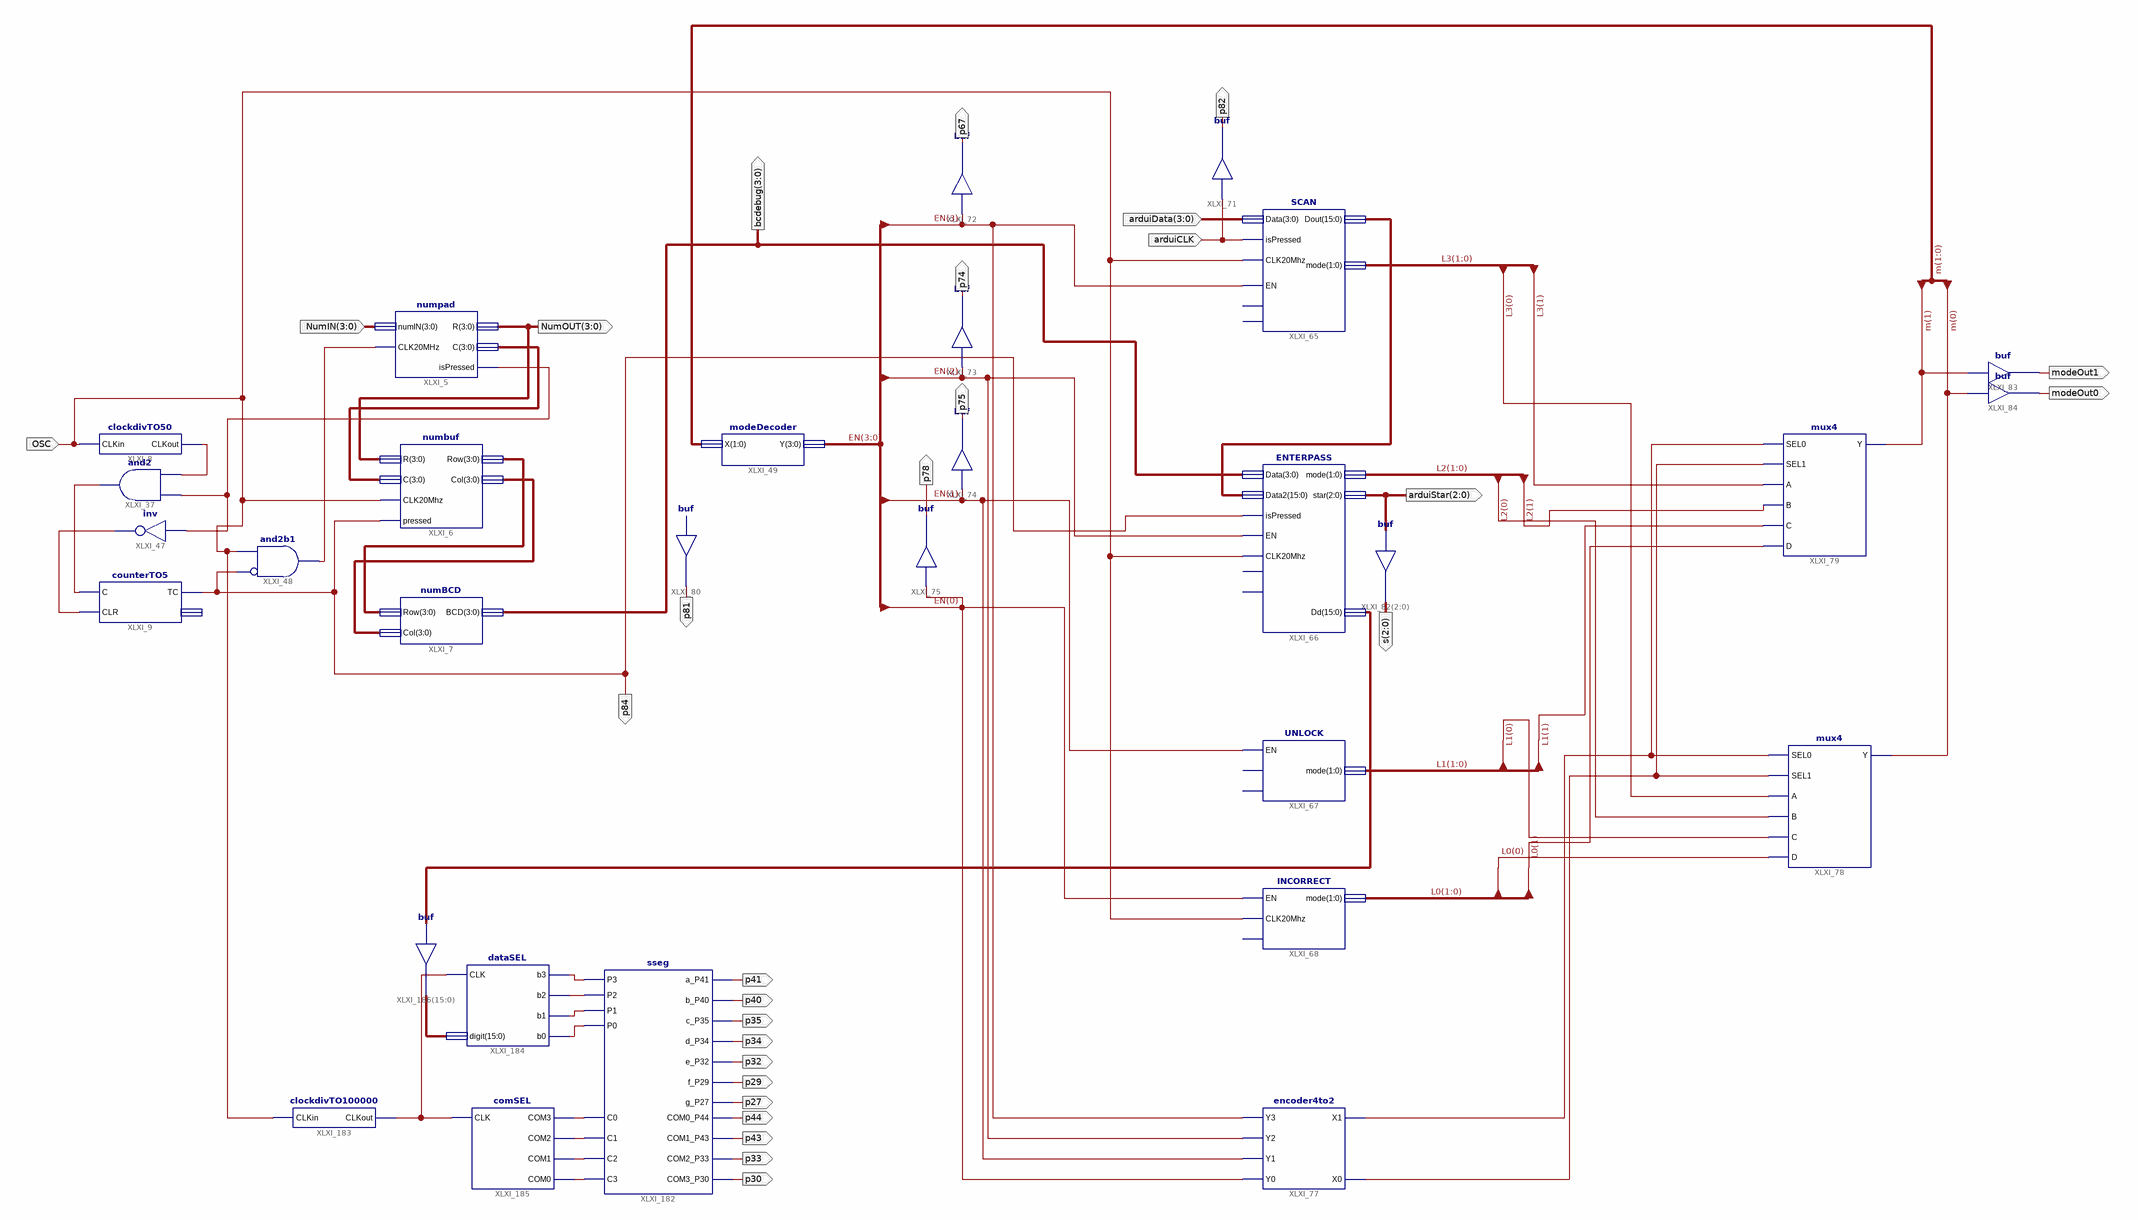
[diagram p0: schematic sheet 1]
// Xilinx ISE schematic main.sch (spartan6) as structural Verilog: 30 symbols, 28 ports
module main (
  input  OSC,
  input  [3:0] arduiData,
  input  arduiCLK,
  input  [3:0] NumIN,
  output modeOut0,
  output modeOut1,
  output [2:0] s,
  output [2:0] arduiStar,
  output p81,
  output [3:0] bcdebug,
  output p84,
  output p75,
  output p74,
  output p67,
  output p82,
  output [3:0] NumOUT,
  output p78,
  output p41,
  output p40,
  output p35,
  output p32,
  output p34,
  output p29,
  output p27,
  output p44,
  output p43,
  output p33,
  output p30
);

  wire XLXN_36, XLXN_37, XLXN_39, XLXN_45, XLXN_49, XLXN_204, XLXN_205, XLXN_407, XLXN_408, XLXN_409,
       XLXN_410, XLXN_411, XLXN_412, XLXN_413, XLXN_414, XLXN_428;
  wire [1:0] L0, L1, L2, L3, m;
  wire [3:0] EN, XLXN_7, XLXN_8, XLXN_12;
  wire [15:0] XLXN_432, XLXN_433, XLXN_434;

  buf XLXI_84 (modeOut0, m[0]);
  buf XLXI_83 (modeOut1, m[1]);
  assign s = arduiStar;  // buf XLXI_82[2..0], 3 bits wide
  // buf XLXI_80 has open pins: I=open, O=p81
  mux4 XLXI_78 (.SEL0(XLXN_204), .SEL1(XLXN_205), .A(L3[0]), .B(L2[0]), .C(L1[0]), .D(L0[0]), .Y(m[0]));
  mux4 XLXI_79 (.SEL0(XLXN_204), .SEL1(XLXN_205), .A(L3[1]), .B(L2[1]), .C(L1[1]), .D(L0[1]), .Y(m[1]));
  encoder4to2 XLXI_77 (.Y3(EN[3]), .Y2(EN[2]), .Y1(EN[1]), .Y0(EN[0]), .X1(XLXN_204), .X0(XLXN_205));
  buf XLXI_74 (p75, EN[1]);
  buf XLXI_73 (p74, EN[2]);
  buf XLXI_72 (p67, EN[3]);
  buf XLXI_71 (p82, arduiCLK);
  ENTERPASS XLXI_66 (
    .Data(bcdebug), .CLK20Mhz(OSC), .EN(EN[2]), .isPressed(p84), .Data2(XLXN_433), .star(arduiStar),
    .mode(L2), .Dd(XLXN_434));  // open: CLRmemo, CLR
  INCORRECT XLXI_68 (.EN(EN[0]), .CLK20Mhz(OSC), .mode(L0));  // open: CLR
  UNLOCK XLXI_67 (.EN(EN[1]), .mode(L1));  // open: TTL, CLR
  SCAN XLXI_65 (
    .EN(EN[3]), .isPressed(arduiCLK), .CLK20Mhz(OSC), .Data(arduiData), .Dout(XLXN_433), .mode(L3));  // open: CLR, CLRmemo
  modeDecoder XLXI_49 (.X(m), .Y(EN));
  and XLXI_48 (XLXN_49, ~p84, OSC);  // and2b1
  not XLXI_47 (XLXN_45, XLXN_37);
  counterTO5 XLXI_9 (.C(XLXN_39), .CLR(XLXN_45), .TC(p84));  // open: Q
  and XLXI_37 (XLXN_39, XLXN_37, XLXN_36);
  numbuf XLXI_6 (.Row(XLXN_8), .R(NumOUT), .C(XLXN_7), .Col(XLXN_12), .CLK20Mhz(OSC), .pressed(p84));
  numBCD XLXI_7 (.Row(XLXN_8), .Col(XLXN_12), .BCD(bcdebug));
  numpad XLXI_5 (.numIN(NumIN), .R(NumOUT), .C(XLXN_7), .isPressed(XLXN_37), .CLK20MHz(XLXN_49));
  clockdivTO50 XLXI_8 (.CLKin(OSC), .CLKout(XLXN_36));
  buf XLXI_75 (p78, EN[0]);
  sseg XLXI_182 (
    .P1(XLXN_409), .P3(XLXN_407), .P2(XLXN_408), .P0(XLXN_410), .C0(XLXN_411), .C1(XLXN_412), .C2(XLXN_413),
    .C3(XLXN_414), .a_P41(p41), .b_P40(p40), .c_P35(p35), .d_P34(p34), .e_P32(p32), .f_P29(p29), .g_P27(p27),
    .COM0_P44(p44), .COM1_P43(p43), .COM2_P33(p33), .COM3_P30(p30));
  clockdivTO100000 XLXI_183 (.CLKin(OSC), .CLKout(XLXN_428));
  dataSEL XLXI_184 (.CLK(XLXN_428), .digit(XLXN_432), .b3(XLXN_407), .b2(XLXN_408), .b1(XLXN_409), .b0(XLXN_410));
  comSEL XLXI_185 (.CLK(XLXN_428), .COM3(XLXN_411), .COM2(XLXN_412), .COM1(XLXN_413), .COM0(XLXN_414));
  assign XLXN_432 = XLXN_434;  // buf XLXI_186[15..0], 16 bits wide
endmodule
